# Altium project pca20053.PrjPCB (part 1 of 4)
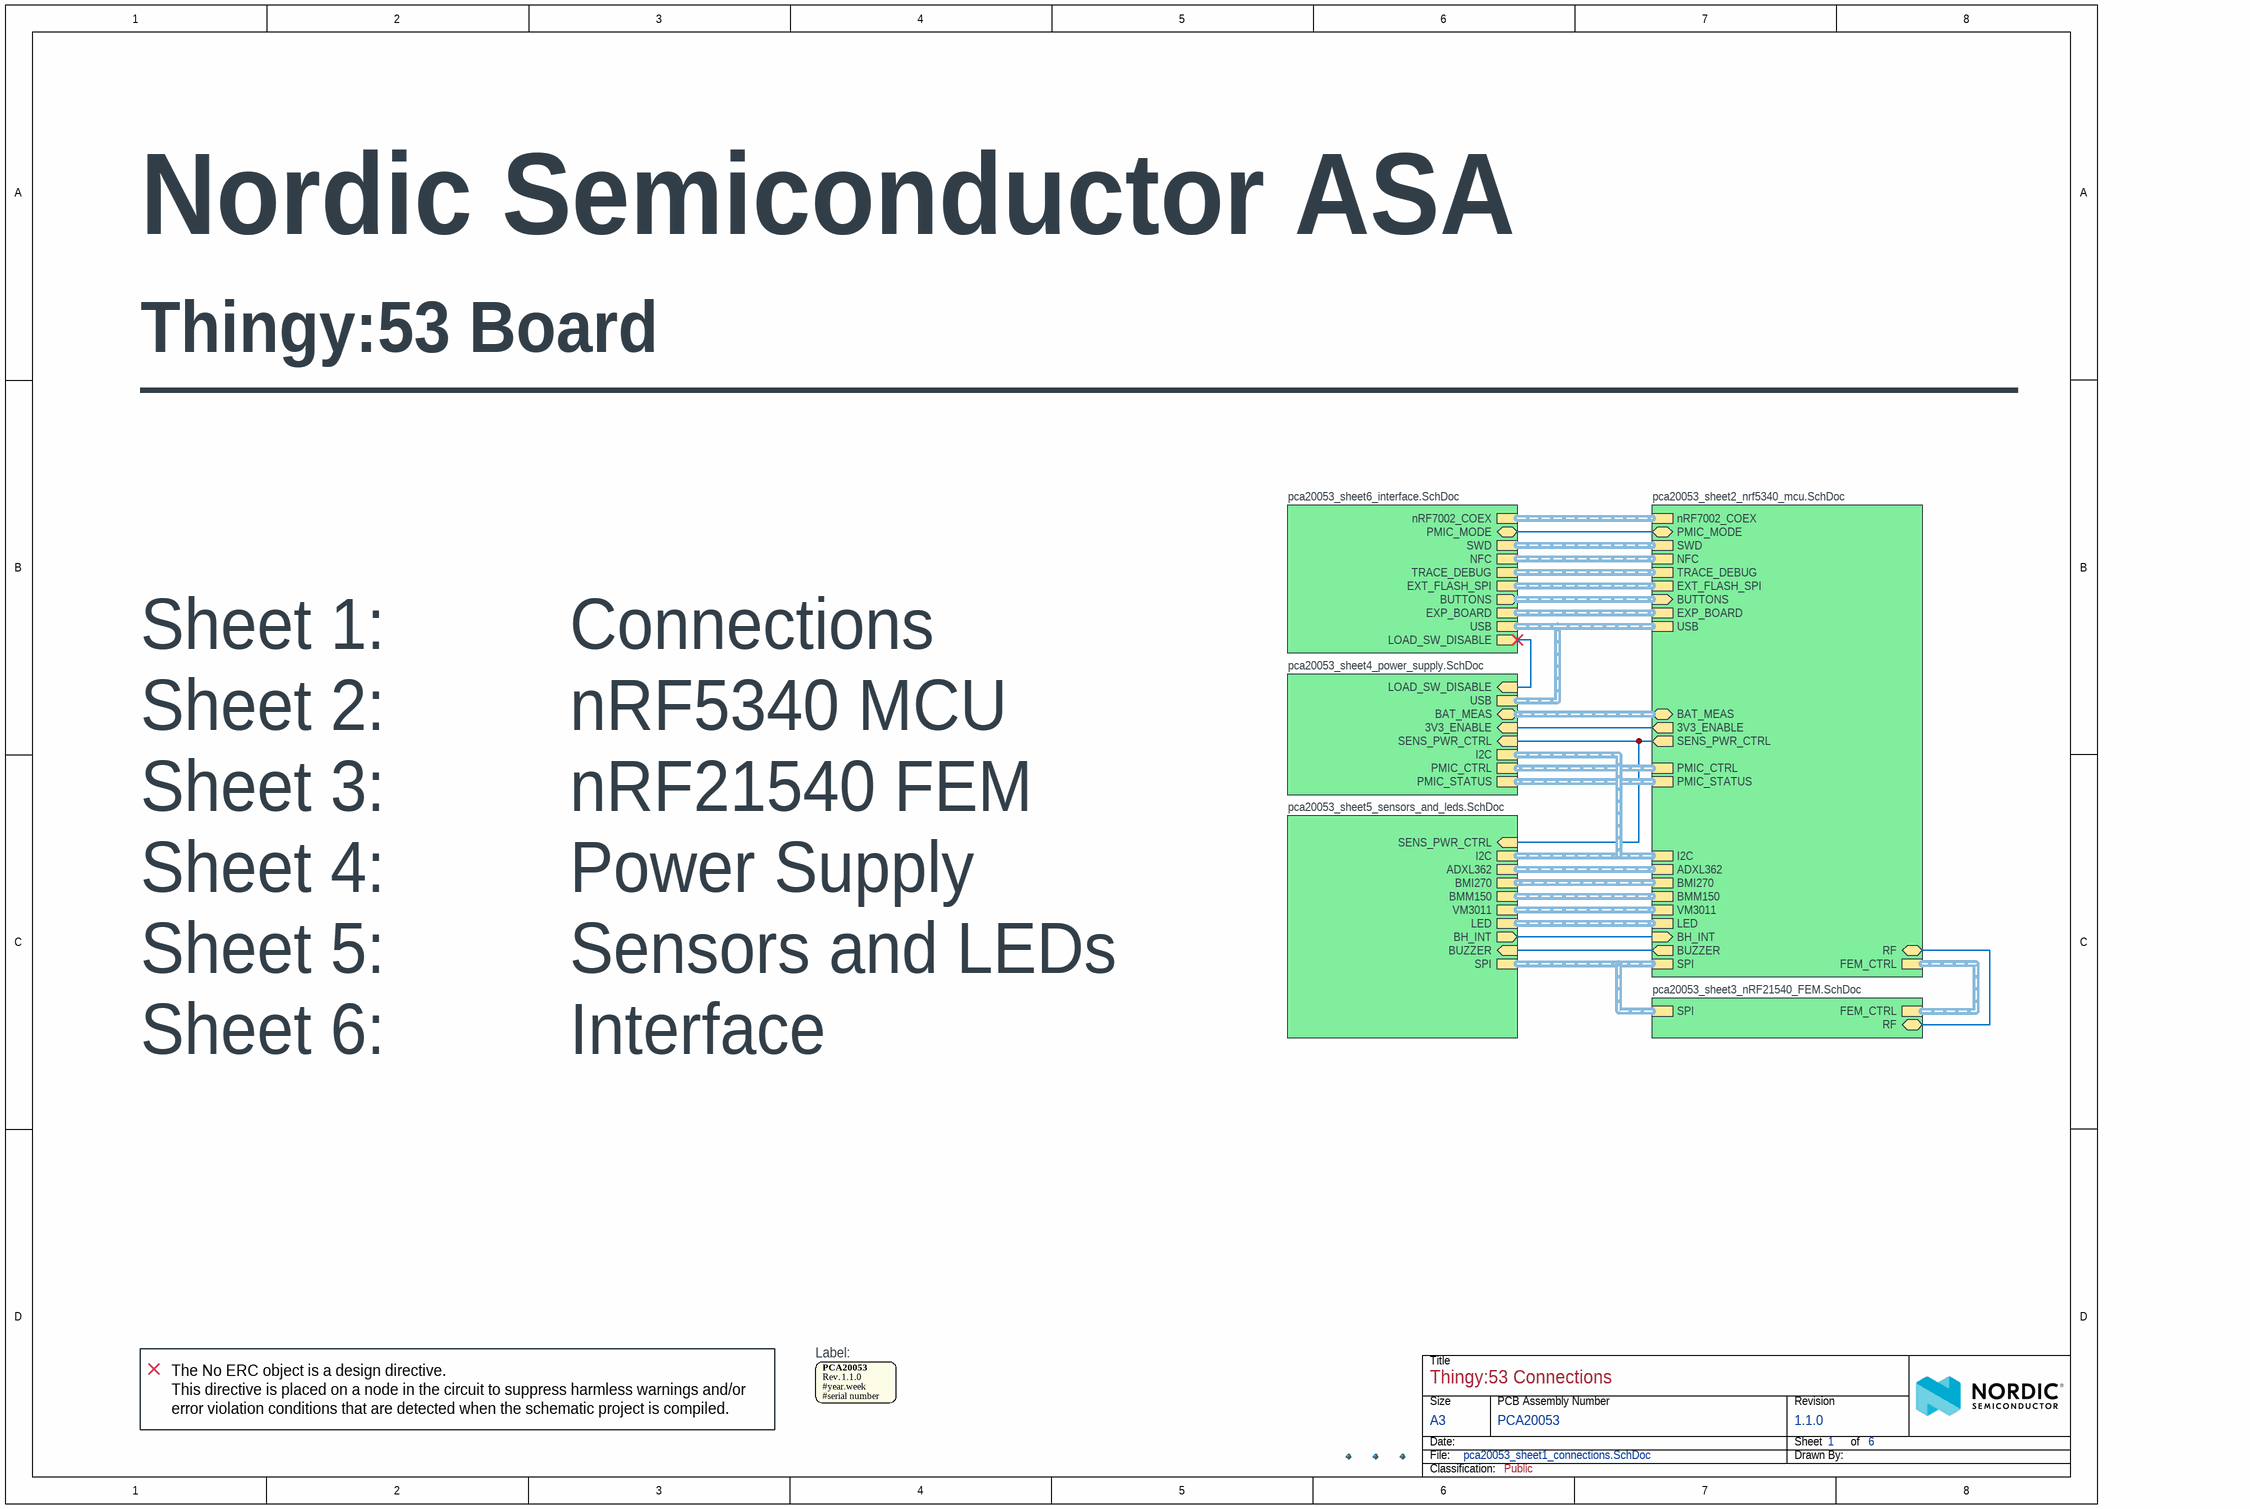
[diagram p0: pca20053_sheet1_connections.SchDoc]
Author: MASI; BoardThickness: 1.6mm; BoardTitle: Thingy:53 Board; Classification: Public; Designer: MASI; LaminateMaterial: FR4, Halogen-Free; NrOfLayers: 4; Organization: Nordic Semiconductor; PCAName: PCA20053; PCARevision: 1.1.0; PCBNumber: 400501; PCBRevision: 0059MASI; PCBStackup: 4001; ProjectName: Thingy:53; ProjectNumber: 4471; Revision: 1.1.0; SilkscreenColor: White, Halogen-Free; SoldermaskColor: Blue, Halogen-Free; SurfaceFinish: ENIG Gold
6 sheets, 236 parts. Net scope: hierarchical (ports join the sheet entries above them; power ports are global).
Board file: 400501.PcbDoc
Sheets:
  pca20053_sheet1_connections.SchDoc
     = pca20053_sheet2_nrf5340_mcu.SchDoc
     = pca20053_sheet5_sensors_and_leds.SchDoc
     = pca20053_sheet3_nRF21540_FEM.SchDoc
     = pca20053_sheet6_interface.SchDoc
     = pca20053_sheet4_power_supply.SchDoc

## Sheet pca20053_sheet1_connections.SchDoc: Thingy:53 Connections
size A3; Organization: Nordic Semiconductor; DocumentNumber: 1; Revision: 1.1.0; SheetNumber: 1; SheetTotal: 6; Author: MASI; CompanyName: Nordic Semiconductor; DrawnBy: MASI; DocumentSize: A3; ProjectName: Thingy:53

### Parts
Fid1  Fiducial mark  [Fiducial_Round-Square]  (value not drawn)
Fid2  Fiducial mark  [Fiducial_Round-Square]  (value not drawn)
Fid3  Fiducial mark  [Fiducial_Round-Square]  (value not drawn)
LABEL  8x32mm  [LabelSilk_8x32]  (value not drawn)

### Sub-sheets
? = pca20053_sheet2_nrf5340_mcu.SchDoc: USB (harness USB), SWD (harness SWD), FEM_CTRL (harness FEM_CTRL), BUZZER (out), BH_INT (in), LED (harness LED), I2C (harness I2C), BUTTONS (in, harness BUTTONS), SPI (harness SPI), BMI270 (harness BMI270), ADXL362 (harness ADXL), RF (bidir), PMIC_STATUS (harness PMIC_STATUS), NFC (harness NFC), VM3011 (harness VM3011), BMM150 (harness BMM150), TRACE_DEBUG (harness TRACE), EXT_FLASH_SPI (harness QSPI), EXP_BOARD (harness EXP_BOARD), PMIC_CTRL (harness PMIC_CTRL), BAT_MEAS (bidir, harness BAT_MEAS), 3V3_ENABLE (out), SENS_PWR_CTRL (out), PMIC_MODE (bidir), nRF7002_COEX (harness PMIC_STATUS)
? = pca20053_sheet5_sensors_and_leds.SchDoc: BUZZER (in), I2C (harness I2C), BH_INT (out), LED (harness LED), SPI (harness SPI), ADXL362 (harness ADXL), BMI270 (harness BMI270), VM3011 (harness VM3011), BMM150 (harness BMM150), SENS_PWR_CTRL (in)
? = pca20053_sheet3_nRF21540_FEM.SchDoc: FEM_CTRL (harness FEM_CTRL), RF (bidir), SPI (harness SPI)
? = pca20053_sheet6_interface.SchDoc: USB (harness USB), SWD (harness SWD), BUTTONS (out, harness BUTTONS), LOAD_SW_DISABLE (out), NFC (harness NFC), TRACE_DEBUG (harness TRACE), EXT_FLASH_SPI (harness QSPI), EXP_BOARD (harness EXP_BOARD), PMIC_MODE (bidir), nRF7002_COEX (harness PMIC_STATUS)
? = pca20053_sheet4_power_supply.SchDoc: USB (harness USB), PMIC_STATUS (harness PMIC_STATUS), LOAD_SW_DISABLE (in), PMIC_CTRL (harness PMIC_CTRL), BAT_MEAS (bidir, harness BAT_MEAS), 3V3_ENABLE (in), SENS_PWR_CTRL (in), I2C (harness I2C)

### Nets
EN: sheet /LOAD_SW_DISABLE, sheet /LOAD_SW_DISABLE
P0.15/QSPI2: sheet /3V3_ENABLE, sheet /3V3_ENABLE
P0.31: sheet /SENS_PWR_CTRL, sheet /SENS_PWR_CTRL, sheet /SENS_PWR_CTRL
P1.05: sheet /BH_INT, sheet /BH_INT
P1.15: sheet /BUZZER, sheet /BUZZER
RF: sheet /RF, sheet /RF
NetSB7_1: sheet /PMIC_MODE, sheet /PMIC_MODE

### Notes on the sheet
- Nordic Semiconductor ASA
- ___________________________________________
- Sheet 1:          Connections
- Sheet 2:          nRF5340 MCU
- Sheet 3:          nRF21540 FEM
- Sheet 4:          Power Supply
- Sheet 5:          Sensors and LEDs
- Sheet 6:          Interface
- (near LABEL) Label:
- (near LABEL) The No ERC object is a design directive.
  This directive is placed on a node in the circuit to suppress harmless warnings and/or error violation conditions that are detected when the schematic project is compiled.
- Title
- Size
- Date:
- File:
- A3
- PCB Assembly Number
- Sheet         of
- Drawn By:
- Revision
- Classification:
- (in symbol Label_8x32) Rev.; #year.week; #serial number

### Library data of the parts
Fid1-Fid3 = Fid-Mark-Round-Square: Manufacturer: N.A.; Part number NEMS: 100500075; Value: N.A.; Pad Count: 1; Component Status: Active; System: Connector; Part Number: Fid-Mark-Round-Square; Manufacturer Part Number: N.A.; LatestRevisionDate: 2017-01-30; Published: 2009-12-12; Note: N.A.; Artikkelnr Noca: N.A.; Footprint Doc: Fiducial; Part number IPS: N.A.; ComponentLink1URL: N.A.; ComponentLink1Description: Datasheet; ComponentLink2URL: N.A.; ComponentLink2Description: Supplier link; HelpURL: N.A.; Supplier 1: N.A.; Supplier Part Number 1: N.A.; Supplier 2: N.A.; Supplier Part Number 2: N.A.; Component Class: Connectors; PartId: 100500075; Author: rsk; Part number Norautron: N.A.
LABEL = Label_8x32: PCA version label, stick-on, 8x32mm; Manufacturer: Ellco Etikett; Manufacturer Part Number: 57382; Part number NEMS: 101200026; Component Status: Active; Pad Count: 0; Note: N.A.; Part Number: Label_8x32; PartId: 101200026; Component Class: Mechanicals; Author: hany; ComponentLink1URL: N.A.; ComponentLink1Description: Datasheet; ComponentLink2URL: N.A.; ComponentLink2Description: Supplier link; HelpURL: N.A.; LatestRevisionDate: 2023-01-05; Published: 2023-01-05; Footprint Doc: Label; Value: 8x32mm; Supplier 1: N.A.; Supplier Part Number 1: N.A.; Supplier 2: N.A.; Supplier Part Number 2: N.A.; Artikkelnr Noca: N.A.; Part number IPS: N.A.; Part number Norautron: N.A.

## Sheet pca20053_sheet2_nrf5340_mcu.SchDoc: Thingy:53 nRF5340 MCU
size A3; Organization: Nordic Semiconductor; DocumentNumber: 2; Revision: 1.1.0; SheetNumber: 2; SheetTotal: 6; Author: MASI; CompanyName: Nordic Semiconductor; DrawnBy: MASI; DocumentSize: A3; ProjectName: Thingy:53
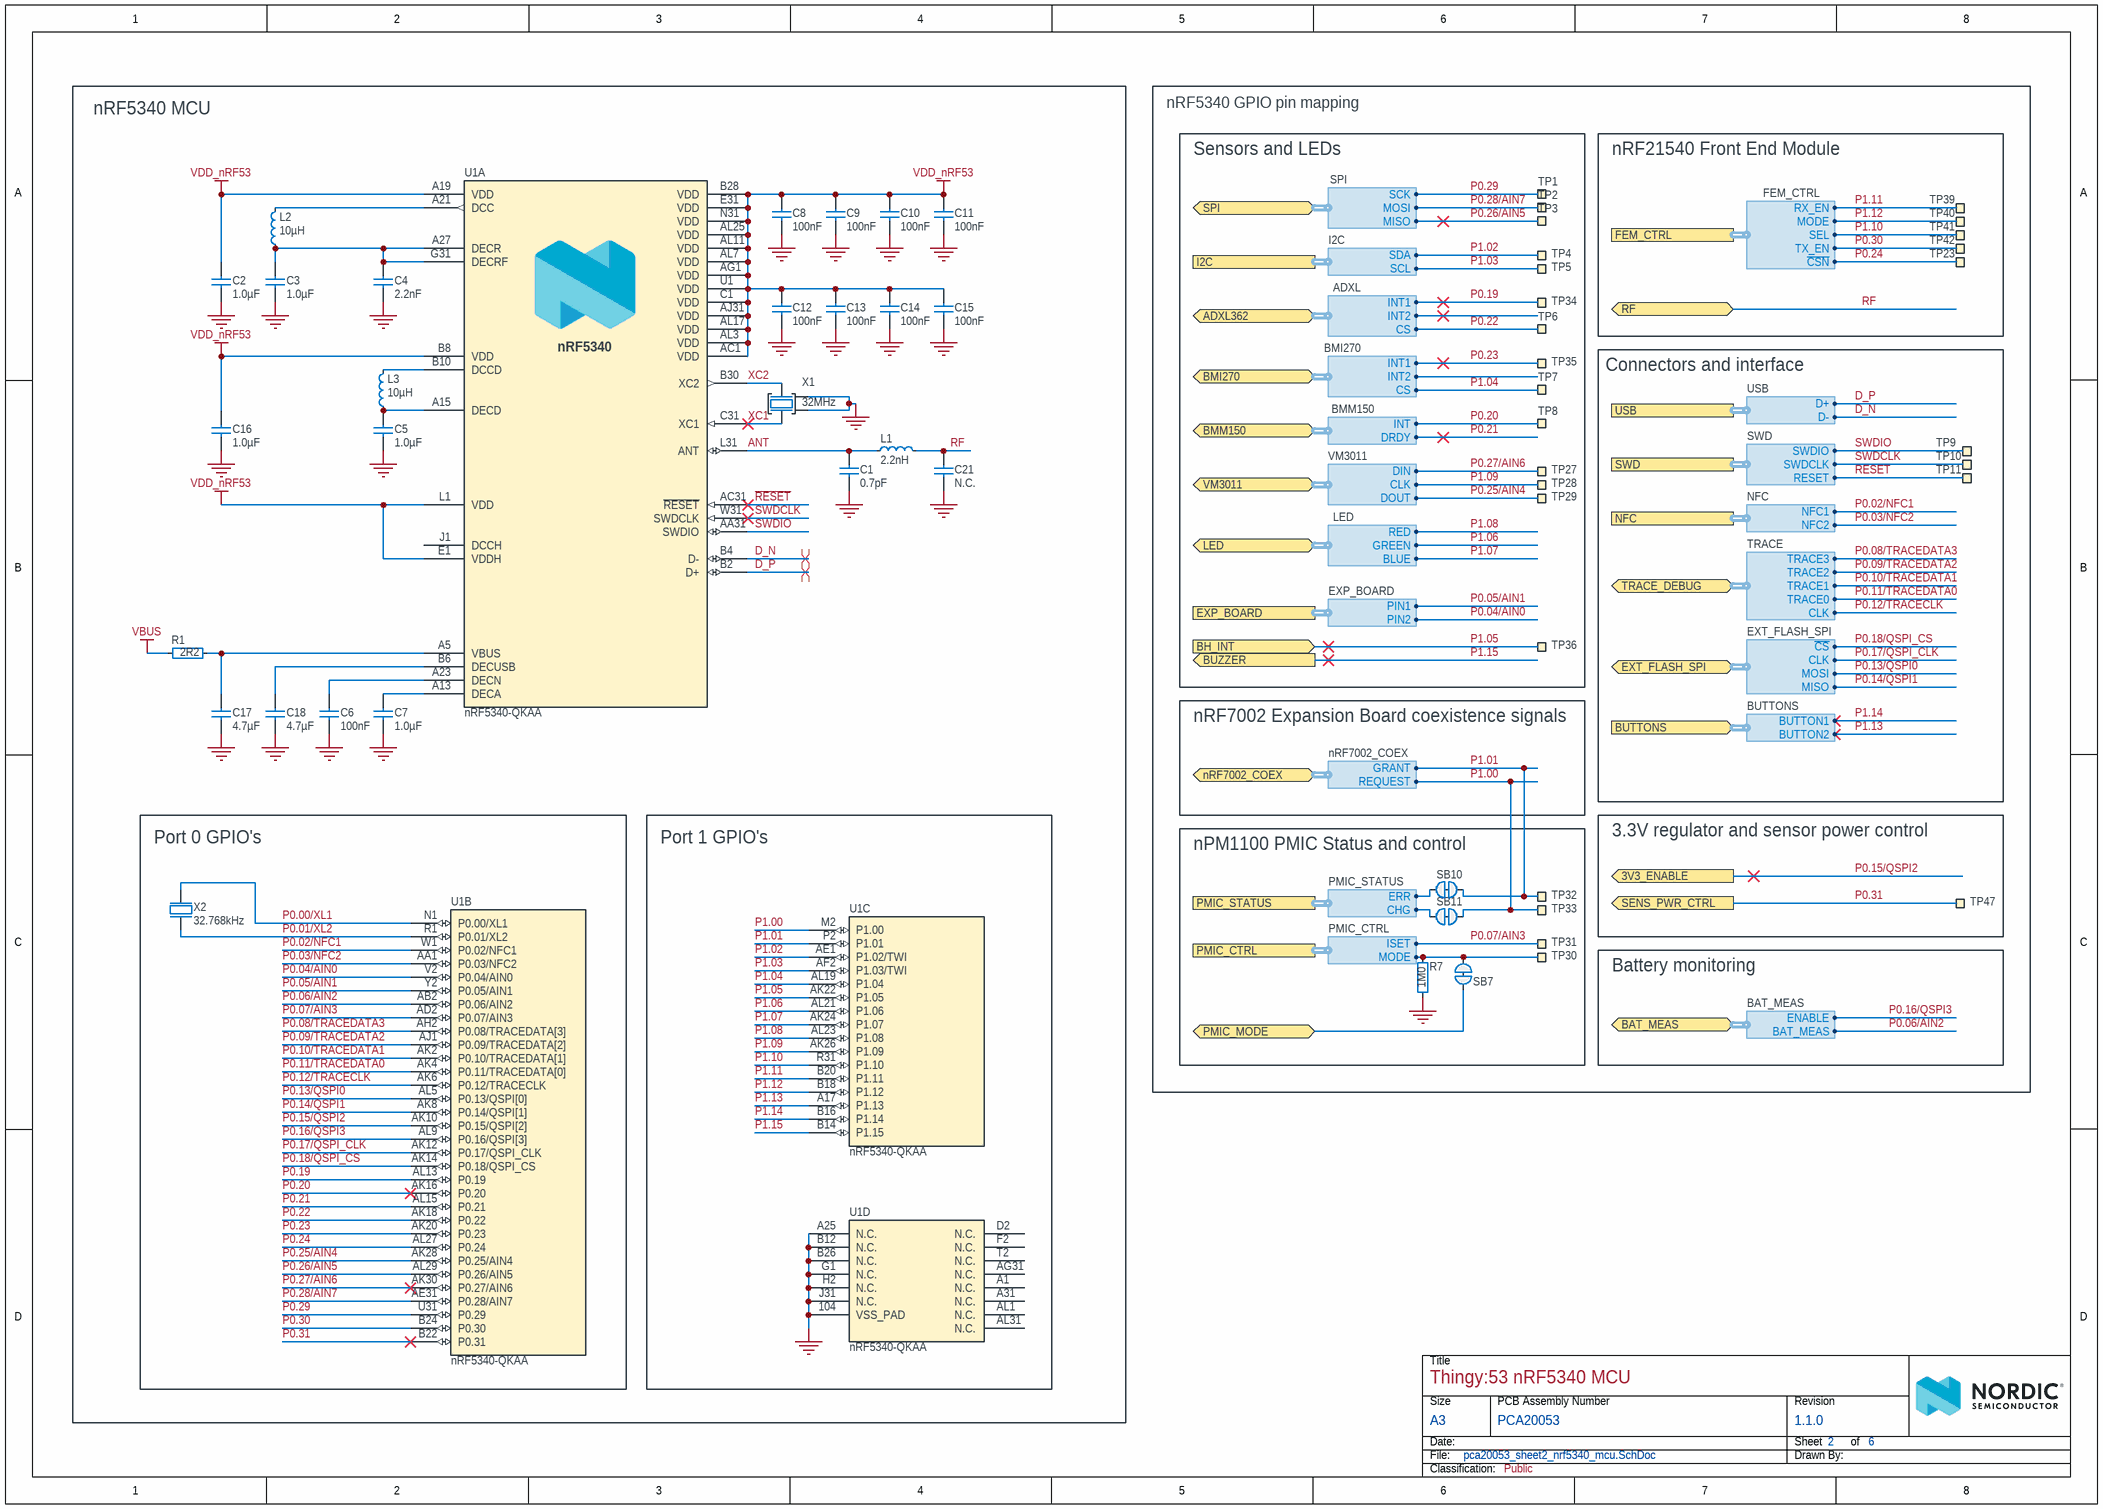
[diagram p1: pca20053_sheet2_nrf5340_mcu.SchDoc]

### Parts
C1  0.7pF  [CAPC0603X03L_C]
C2  1.0µF  [CAPC1005X04L]
C3  1.0µF  [CAPC1005X04L]
C4  2.2nF  [CAPC0603X03L_C]
C5  1.0µF  [CAPC1005X04L]
C6  100nF  [CAPC0603X03L_C]
C7  1.0µF  [CAPC1005X04L]
C8  100nF  [CAPC0603X03L_C]
C9  100nF  [CAPC0603X03L_C]
C10  100nF  [CAPC0603X03L_C]
C11  100nF  [CAPC0603X03L_C]
C12  100nF  [CAPC0603X03L_C]
C13  100nF  [CAPC0603X03L_C]
C14  100nF  [CAPC0603X03L_C]
C15  100nF  [CAPC0603X03L_C]
C16  1.0µF  [CAPC1005X04L]
C17  4.7µF  [CAPC1608X06L]
C18  4.7µF  [CAPC1608X06L]
C21  N.C.  [CAPC0603X03L_C_NC]
L1  2.2nH  [INDC0603X03L_C]
L2  10µH  [INDC1608X06L]
L3  10µH  [INDC1608X06L]
R1  2R2  [RESC0603X03L_C]
R7  1M0  [RESC0603X03L_C]
SB7  Solderbridge  [Solderbridge_Shorted]  (value not drawn)  (net tie, no BOM)
SB10  Solderbridge  [Solderbridge_Shorted]  (value not drawn)  (net tie, no BOM)
SB11  Solderbridge  [Solderbridge_Shorted]  (value not drawn)  (net tie, no BOM)
TP1  Ø1.5mm,SMD  [TP_SMD_D1.5mm]  (value not drawn)  (no BOM)
TP2  Ø1.5mm,SMD  [TP_SMD_D1.5mm]  (value not drawn)  (no BOM)
TP3  Ø1.5mm,SMD  [TP_SMD_D1.5mm]  (value not drawn)  (no BOM)
TP4  Ø1.5mm,SMD  [TP_SMD_D1.5mm]  (value not drawn)  (no BOM)
TP5  Ø1.5mm,SMD  [TP_SMD_D1.5mm]  (value not drawn)  (no BOM)
TP6  Ø1.0mm,SMD  [TP_SMD_D1.0mm]  (value not drawn)  (no BOM)
TP7  Ø1.0mm,SMD  [TP_SMD_D1.0mm]  (value not drawn)  (no BOM)
TP8  Ø1.0mm,SMD  [TP_SMD_D1.0mm]  (value not drawn)  (no BOM)
TP9  Ø1.5mm,SMD  [TP_SMD_D1.5mm]  (value not drawn)  (no BOM)
TP10  Ø1.5mm,SMD  [TP_SMD_D1.5mm]  (value not drawn)  (no BOM)
TP11  Ø1.5mm,SMD  [TP_SMD_D1.5mm]  (value not drawn)  (no BOM)
TP23  Ø1.5mm,SMD  [TP_SMD_D1.5mm]  (value not drawn)  (no BOM)
TP27  Ø0.7mm,SMD  [TP_SMD_D0.7mm]  (value not drawn)  (no BOM)
TP28  Ø0.7mm,SMD  [TP_SMD_D0.7mm]  (value not drawn)  (no BOM)
TP29  Ø0.7mm,SMD  [TP_SMD_D0.7mm]  (value not drawn)  (no BOM)
TP30  Ø0.7mm,SMD  [TP_SMD_D0.7mm]  (value not drawn)  (no BOM)
TP31  Ø0.7mm,SMD  [TP_SMD_D0.7mm]  (value not drawn)  (no BOM)
TP32  Ø1.5mm,SMD  [TP_SMD_D1.5mm]  (value not drawn)  (no BOM)
TP33  Ø1.5mm,SMD  [TP_SMD_D1.5mm]  (value not drawn)  (no BOM)
TP34  Ø0.7mm,SMD  [TP_SMD_D0.7mm]  (value not drawn)  (no BOM)
TP35  Ø0.7mm,SMD  [TP_SMD_D0.7mm]  (value not drawn)  (no BOM)
TP36  Ø0.7mm,SMD  [TP_SMD_D0.7mm]  (value not drawn)  (no BOM)
TP39  Ø1.5mm,SMD  [TP_SMD_D1.5mm]  (value not drawn)  (no BOM)
TP40  Ø1.5mm,SMD  [TP_SMD_D1.5mm]  (value not drawn)  (no BOM)
TP41  Ø1.5mm,SMD  [TP_SMD_D1.5mm]  (value not drawn)  (no BOM)
TP42  Ø1.5mm,SMD  [TP_SMD_D1.5mm]  (value not drawn)  (no BOM)
TP47  Ø0.7mm,SMD  [TP_SMD_D0.7mm]  (value not drawn)  (no BOM)
U1  nRF5340-QKAA  [AQFN40P700X700X85_HS-99N]  (parts A,B,C,D of 4)
X1  32MHz  [BT-XTAL_2016]
X2  32.768kHz  [XTAL_2012]

### Blocks framed on the sheet
nRF5340 MCU: C1-C18 C21 L1-L3 R1 U1 X1
Sensors and LEDs: TP1-TP8 TP27-TP29 TP34-TP36
nRF21540 Front End Module: TP23 TP39-TP42
Connectors and interface: TP9-TP11
Port 0 GPIO's: U1 X2
Port 1 GPIO's: U1
3.3V regulator and sensor power control: TP47
nPM1100 PMIC Status and control: R7 SB7 SB10 SB11 TP30-TP33

### Ports
3V3_ENABLE (out), ADXL362 (bidir, harness ADXL), BAT_MEAS (bidir, harness BAT_MEAS), BH_INT (in), BMI270 (bidir, harness BMI270), BMM150 (bidir, harness BMM150), BUTTONS (in, harness BUTTONS), BUZZER (out), EXP_BOARD (harness EXP_BOARD), EXT_FLASH_SPI (bidir, harness EXT_FLASH_SPI), FEM_CTRL (harness FEM_CTRL), I2C (harness I2C), LED (bidir, harness LED), NFC (harness NFC), nRF7002_COEX (bidir, harness nRF7002_COEX), PMIC_CTRL (harness PMIC_CTRL), PMIC_MODE (bidir), PMIC_STATUS (harness PMIC_STATUS), RF (bidir), SENS_PWR_CTRL (out), SPI (bidir, harness SPI), SWD (harness SWD), TRACE_DEBUG (bidir, harness TRACE), USB (harness USB), VM3011 (bidir, harness VM3011)

### Harnesses
VM3011: DIN, CLK, DOUT
LED: BLUE, GREEN, RED
SPI: MISO, MOSI, SCK
BMI270: INT2, INT1, CS
ADXL: CS, INT2, INT1
SWD: SWDIO, SWDCLK, RESET
USB: D+, D-
NFC: NFC2, NFC1
I2C: SCL, SDA
FEM_CTRL: MODE, RX_EN, SEL, TX_EN, ~{CSN}
TRACE: TRACE3, TRACE2, TRACE1, TRACE0, CLK
BMM150: DRDY, INT
EXT_FLASH_SPI: ~{CS}, CLK, MOSI, MISO
EXP_BOARD: PIN1, PIN2
PMIC_CTRL: ISET, MODE
PMIC_STATUS: ERR, CHG
BAT_MEAS: BAT_MEAS, ENABLE
BUTTONS: BUTTON1, BUTTON2
nRF7002_COEX: REQUEST, GRANT

### Nets
GND: C1.1 C2.2 C3.1 C4.2 C5.1 C6.2 C7.1 C8.2 C9.2 C10.2 C11.2 C12.2 C13.2 C14.2 C15.2 C16.1 C17.2 C18.2 C21.1 R7.1 U1.104(VSS_PAD) U1.A25(N.C.) U1.B12(N.C.) U1.B26(N.C.) U1.G1(N.C.) U1.H2(N.C.) U1.J31(N.C.) X1.2(GND) X1.4(GND)
VBUS: R1.1
VDD_nRF53: C2.1 C8.1 C9.1 C10.1 C11.1 C12.1 C13.1 C14.1 C15.1 C16.2 U1.A19(VDD) U1.AC1(VDD) U1.AG1(VDD) U1.AJ31(VDD) U1.AL3(VDD) U1.AL7(VDD) U1.AL11(VDD) U1.AL17(VDD) U1.AL25(VDD) U1.B8(VDD) U1.B28(VDD) U1.C1(VDD) U1.E1(VDDH) U1.E31(VDD) U1.L1(VDD) U1.N31(VDD) U1.U1(VDD)
ANT: C1.2 L1.2 U1.L31(ANT)
CHG: SB11.2 ; port PMIC_STATUS.CHG
D_N: U1.B4(D-) ; port USB.D-
D_P: U1.B2(D+) ; port USB.D+
ERR: SB10.2 ; port PMIC_STATUS.ERR
MODE: R7.2 SB7.2 TP30.1 ; port PMIC_CTRL.MODE
P0.00/XL1: U1.N1(P0.00/XL1) X2.1(inp)
P0.01/XL2: U1.R1(P0.01/XL2) X2.2(out)
P0.02/NFC1: U1.W1(P0.02/NFC1) ; port NFC.NFC1
P0.03/NFC2: U1.AA1(P0.03/NFC2) ; port NFC.NFC2
P0.04/AIN0: U1.V2(P0.04/AIN0) ; port EXP_BOARD.PIN2  [project net EXP_BOARD_PIN2]
P0.05/AIN1: U1.Y2(P0.05/AIN1) ; port EXP_BOARD.PIN1  [project net EXP_BOARD_PIN1]
P0.06/AIN2: U1.AB2(P0.06/AIN2) ; port BAT_MEAS.BAT_MEAS
P0.07/AIN3: TP31.1 U1.AD2(P0.07/AIN3) ; port PMIC_CTRL.ISET  [project net ISET]
P0.08/TRACEDATA3: U1.AH2(P0.08/TRACEDATA[3]) ; port TRACE_DEBUG.TRACE3
P0.09/TRACEDATA2: U1.AJ1(P0.09/TRACEDATA[2]) ; port TRACE_DEBUG.TRACE2
P0.10/TRACEDATA1: U1.AK2(P0.10/TRACEDATA[1]) ; port TRACE_DEBUG.TRACE1
P0.11/TRACEDATA0: U1.AK4(P0.11/TRACEDATA[0]) ; port TRACE_DEBUG.TRACE0
P0.12/TRACECLK: U1.AK6(P0.12/TRACECLK) ; port TRACE_DEBUG.CLK
P0.13/QSPI0: U1.AL5(P0.13/QSPI[0]) ; port EXT_FLASH_SPI.MOSI
P0.14/QSPI1: U1.AK8(P0.14/QSPI[1]) ; port EXT_FLASH_SPI.MISO
P0.15/QSPI2: U1.AK10(P0.15/QSPI[2]) ; port 3V3_ENABLE
P0.16/QSPI3: U1.AL9(P0.16/QSPI[3]) ; port BAT_MEAS.ENABLE
P0.17/QSPI_CLK: U1.AK12(P0.17/QSPI_CLK) ; port EXT_FLASH_SPI.CLK
P0.18/QSPI_CS: U1.AK14(P0.18/QSPI_CS) ; port EXT_FLASH_SPI.~{CS}
P0.19: TP34.1 U1.AL13(P0.19) ; port ADXL362.INT1
P0.20: TP8.1 U1.AK16(P0.20) ; port BMM150.INT
P0.21: U1.AL15(P0.21) ; port BMM150.DRDY
P0.22: TP6.1 U1.AK18(P0.22) ; port ADXL362.CS
P0.23: TP35.1 U1.AK20(P0.23) ; port BMI270.INT1
P0.24: TP23.1 U1.AL27(P0.24) ; port FEM_CTRL.~{CSN}
P0.25/AIN4: TP29.1 U1.AK28(P0.25/AIN4) ; port VM3011.DOUT
P0.26/AIN5: TP3.1 U1.AL29(P0.26/AIN5) ; port SPI.MISO  [project net MISO]
P0.27/AIN6: TP27.1 U1.AK30(P0.27/AIN6) ; port VM3011.DIN
P0.28/AIN7: TP2.1 U1.AE31(P0.28/AIN7) ; port SPI.MOSI  [project net MOSI]
P0.29: TP1.1 U1.U31(P0.29) ; port SPI.SCK
P0.30: TP42.1 U1.B24(P0.30) ; port FEM_CTRL.TX_EN
P0.31: TP47.1 U1.B22(P0.31) ; port SENS_PWR_CTRL
P1.00: SB11.1 TP33.1 U1.M2(P1.00) ; port nRF7002_COEX.REQUEST
P1.01: SB10.1 TP32.1 U1.P2(P1.01) ; port nRF7002_COEX.GRANT
P1.02: TP4.1 U1.AE1(P1.02/TWI) ; port I2C.SDA
P1.03: TP5.1 U1.AF2(P1.03/TWI) ; port I2C.SCL
P1.04: TP7.1 U1.AL19(P1.04) ; port BMI270.CS
P1.05: TP36.1 U1.AK22(P1.05) ; port BH_INT
P1.06: U1.AL21(P1.06) ; port LED.GREEN
P1.07: U1.AK24(P1.07) ; port LED.BLUE
P1.08: U1.AL23(P1.08) ; port LED.RED
P1.09: TP28.1 U1.AK26(P1.09) ; port VM3011.CLK
P1.10: TP41.1 U1.R31(P1.10) ; port FEM_CTRL.SEL
P1.11: TP39.1 U1.B20(P1.11) ; port FEM_CTRL.RX_EN
P1.12: TP40.1 U1.B18(P1.12) ; port FEM_CTRL.MODE
P1.13: U1.A17(P1.13) ; port BUTTONS.BUTTON2
P1.14: U1.B16(P1.14) ; port BUTTONS.BUTTON1
P1.15: U1.B14(P1.15) ; port BUZZER
~{RESET}: TP11.1 U1.AC31(~{RESET}) ; port SWD.RESET
RF: C21.2 L1.1 ; port RF
SWDCLK: TP10.1 U1.W31(SWDCLK) ; port SWD.SWDCLK
SWDIO: TP9.1 U1.AA31(SWDIO) ; port SWD.SWDIO
XC1: U1.C31(XC1) X1.1(IN)
XC2: U1.B30(XC2) X1.3(OUT)
NetC3_2: C3.2 C4.1 L2.1 U1.A27(DECR) U1.G31(DECRF)
NetC5_2: C5.2 L3.1 U1.A15(DECD)
NetC6_1: C6.1 U1.A23(DECN)
NetC7_2: C7.2 U1.A13(DECA)
NetC17_1: C17.1 R1.2 U1.A5(VBUS)
NetC18_1: C18.1 U1.B6(DECUSB)
NetL2_2: L2.2 U1.A21(DCC)
NetL3_2: L3.2 U1.B10(DCCD)
NetSB7_1: SB7.1 ; port PMIC_MODE

Not connected (* = marked no-connect by the designer): U1 A1(N.C.) A31(N.C.) AG31(N.C.) AL1(N.C.) AL31(N.C.) D2(N.C.) F2(N.C.) J1(DCCH) T2(N.C.)

### Layout directives
differential pair: D_N, D_P

### Notes on the sheet
- nRF5340 GPIO pin mapping
- nRF7002 Expansion Board coexistence signals
- Battery monitoring
- Title
- Size
- Date:
- File:
- A3
- PCB Assembly Number
- Sheet         of
- Drawn By:
- Revision
- Classification:
- (in symbol nRF5340-QKAAD0, part A) nRF5340

### Library data of the parts
C1 = C0201-0.7p-50V-C0G-GJM0335C1HR70WB01: Capacitor, Ceramic, C0G, ±0.05pF, 50V; Manufacturer: Murata; Manufacturer Part Number: GJM0335C1HR70WB01D; Part number NEMS: 100200011; Artikkelnr Noca: N.A.; Pad Count: 2; Component Status: Active; Part Number: C0201-0.7p-50V-C0G-GJM0335C1HR70WB01; LatestRevisionDate: 2023-03-27; Published: 2014-11-13; Value: 0.7pF; Footprint Doc: 0201; Component Class: Capacitors; ComponentLink1Description: Datasheet; ComponentLink1URL: https://search.murata.co.jp/Ceramy/image/img/A01X/G101/ENG/GJM0335C1HR70WB01-01.pdf; ComponentLink2Description: Supplier link; ComponentLink2URL: https://www.murata.com/en-global/products/productdetail?partno=GJM0335C1HR70WB01%23; HelpURL: N.A.; Note: 50V; PartId: 100200011; Part number IPS: N.A.; Supplier 1: Digi-Key; Supplier 2: Mouser; Supplier Part Number 1: 490-17145-1-ND; Supplier Part Number 2: 81-GJM0335C1HR70WB1D; Author: rsk; Part number Norautron: N.A.
C2 C3 C5 C7 C16 = C0402-1µ0-25V-X5R: Capacitor, Ceramic, X5R, ±10%, 25V; Manufacturer: Murata; Manufacturer Part Number: GRM155R61E105KA12D; Part number NEMS: 100200453; Artikkelnr Noca: N.A.; Pad Count: 2; Component Status: Active; Part Number: C0402-1µ0-25V-X5R; LatestRevisionDate: 2020-12-16; Published: 2020-12-16; Value: 1.0µF; Footprint Doc: 0402; Component Class: Capacitors; ComponentLink1Description: Datasheet; ComponentLink1URL: https://search.murata.co.jp/Ceramy/image/img/A01X/G101/ENG/GRM155R61E105KA12-01.pdf; ComponentLink2Description: Supplier link; ComponentLink2URL: https://www.murata.com/en-global/products/productdetail?partno=GRM155R61E105KA12%23; HelpURL: N.A.; Note: 25V; PartId: 100200453; Part number IPS: N.A.; Supplier 1: Digi-Key; Supplier 2: Mouser; Supplier Part Number 1: 490-10017-1-ND; Supplier Part Number 2: 81-GRM155R61E105KA2D; Author: rsk; Part number Norautron: N.A.
C4 = C0201-2n2-10V-X5R: Capacitor, Ceramic, X5R, ±10%, 10V; Manufacturer: Murata; Manufacturer Part Number: GRM033R61A222KA01D; Part number NEMS: 100200455; Artikkelnr Noca: N.A.; Pad Count: 2; Component Status: Active; Part Number: C0201-2n2-10V-X5R; LatestRevisionDate: 2020-12-16; Published: 2020-12-16; Value: 2.2nF; Footprint Doc: 0201; ComponentLink1URL: https://search.murata.co.jp/Ceramy/image/img/A01X/G101/ENG/GRM033R61A222KA01-01.pdf; ComponentLink1Description: Datasheet; ComponentLink2URL: https://www.murata.com/en-global/products/productdetail?partno=GRM033R61A222KA01%23; ComponentLink2Description: Supplier link; HelpURL: N.A.; Note: 10V; Supplier 1: Digi-Key; Supplier Part Number 1: 490-3162-1-ND; Supplier 2: Mouser; Supplier Part Number 2: 81-GRM033R61A222KA1D; Part number IPS: N.A.; Component Class: Capacitors; PartId: 100200455; Author: rsk; Part number Norautron: N.A.
C6 C8-C15 = C0201-100n-6.3V-X5R: Capacitor, Ceramic, X5R, ±10%, 6.3V; Manufacturer: Murata; Manufacturer Part Number: GRM033R60J104KE19D; Part number NEMS: 100200451; Artikkelnr Noca: N.A.; Pad Count: 2; Component Status: Active; Part Number: C0201-100n-6.3V-X5R; LatestRevisionDate: 2020-12-15; Published: 2020-12-15; Value: 100nF; Footprint Doc: 0201; Component Class: Capacitors; ComponentLink1Description: Datasheet; ComponentLink1URL: https://search.murata.co.jp/Ceramy/image/img/A01X/G101/ENG/GRM033R60J104KE19-01.pdf; ComponentLink2Description: Supplier link; ComponentLink2URL: https://www.murata.com/en-eu/products/productdetail?partno=GRM033R60J104KE19%23; HelpURL: N.A.; Note: 6.3V; PartId: 100200451; Part number IPS: N.A.; Supplier 1: Digi-Key; Supplier 2: N.A.; Supplier Part Number 1: 490-3167-1-ND; Supplier Part Number 2: N.A.; Author: rsk; Part number Norautron: N.A.
C17 C18 = C0603-4µ7-25V-X5R: Capacitor, X5R, ±10%, 25V; Manufacturer: Murata; Manufacturer Part Number: GRM188R61E475KE11D; Part number NEMS: 100200352; Artikkelnr Noca: N.A.; Pad Count: 2; Component Status: Active; Part Number: C0603-4µ7-25V-X5R; LatestRevisionDate: 2019-06-11; Published: 2019-06-11; Value: 4.7µF; Footprint Doc: 0603; Component Class: Capacitors; ComponentLink1Description: Datasheet; ComponentLink1URL: https://www.murata.com/~/media/webrenewal/support/library/catalog/products/capacitor/mlcc/c02e.ashx?la=en-us; ComponentLink2Description: Supplier link; ComponentLink2URL: https://www.digikey.com/product-detail/en/murata-electronics-north-america/GRM188R61E475KE11D/490-7203-1-ND/3900450; HelpURL: https://www.murata.com/~/media/webrenewal/support/library/catalog/products/capacitor/mlcc/c02e.ashx?la=en-us; Note: 25V; PartId: 100200352; Part number IPS: N.A.; Supplier 1: Digi-Key; Supplier 2: N.A.; Supplier Part Number 1: 490-7203-1-ND; Supplier Part Number 2: N.A.; Author: rsk; Part number Norautron: N.A.
C21 = C0201-N.C.: Not mounted; Part number NEMS: 100200001; Assembly: Not mounted; Artikkelnr Noca: N.A.; Note: Chip Cap; Pad Count: 2; Component Status: Active; Part Number: C0201-N.C.; LatestRevisionDate: 2014-11-13; Published: 2014-11-13; Value: N.C.; Footprint Doc: 0201; Component Class: Capacitors; ComponentLink1Description: Datasheet; ComponentLink1URL: N.A.; ComponentLink2Description: Supplier link; ComponentLink2URL: N.A.; HelpURL: N.A.; Manufacturer: N.A.; Manufacturer Part Number: N.A.; PartId: 100200001; Part number IPS: N.A.; Supplier 1: N.A.; Supplier 2: N.A.; Supplier Part Number 1: N.A.; Supplier Part Number 2: N.A.; Author: rsk; Part number Norautron: N.A.
L1 = L0201-2n2-HQ-Murata: Inductor, 600mA, ±0.1ｎH, 120mOhm; Manufacturer: Murata; Manufacturer Part Number: LQP03HQ2N2B02; Part number Norautron: 26521773; Part number NEMS: 100300209; Artikkelnr Noca: N.A.; Note: -55°C ~ 125°C; Pad Count: 2; Component Status: Active; Part Number: L0201-2n2-HQ-Murata; Footprint Doc: 0201; LatestRevisionDate: 2018-10-23; Published: 2018-10-23; Value: 2.2nH; Component Class: Inductors; ComponentLink1Description: Datasheet; ComponentLink1URL: https://search.murata.co.jp/Ceramy/image/img/P02/JELF243C-0021.pdf; ComponentLink2Description: Supplier link; ComponentLink2URL: N.A.; HelpURL: https://psearch.en.murata.com/inductor/product/LQP03HQ2N2B02%23.html; PartId: 100300209; Part number IPS: N.A.; Supplier 1: Digi-Key; Supplier 2: N.A.; Supplier Part Number 1: 490-13899-1-ND; Supplier Part Number 2: N.A.; Author: rsk
L2 L3 = L0603-10µ-Murata-DN: Inductor, 100mA, ±20%, 1.05Ohm; Manufacturer: Murata; Manufacturer Part Number: LQM18DN100M70L; Part number NEMS: 100300403; Artikkelnr Noca: N.A.; Note: -55°C ~ 125°C; Pad Count: 2; Component Status: Active; Part Number: L0603-10µ-Murata-DN; LatestRevisionDate: 2021-04-27; Published: 2021-04-27; Value: 10µH; Footprint Doc: 0603; Component Class: Inductors; ComponentLink1Description: Datasheet; ComponentLink1URL: https://search.murata.co.jp/Ceramy/image/img/P02/JELF243B-0086.pdf; ComponentLink2Description: Supplier link; ComponentLink2URL: https://www.digikey.com/en/products/detail/murata-electronics/LQM18DN100M70L/12476609; HelpURL: https://www.murata.com/en-global/products/productdetail?partno=LQM18DN100M70%23; Part number IPS: N.A.; Supplier 1: Digi-Key; Supplier 2: N.A.; Supplier Part Number 1: 490-LQM18DN100M70LCT-ND; Supplier Part Number 2: N.A.; Author: rubr; Part number Norautron: N.A.; PartId: 100300403
R1 = R0201-2R2: Resistor, ±1%, 0.05W; Part number Norautron: 26470029; Part number NEMS: 100100006; Artikkelnr Noca: N.A.; Note: Chip Res 1%; Pad Count: 2; Component Status: Active; Part Number: R0201-2R2; Footprint Doc: 0201; LatestRevisionDate: 2014-11-13; Published: 2014-11-13; Value: 2R2; Component Class: Resistors; ComponentLink1Description: Datasheet; ComponentLink1URL: N.A.; ComponentLink2Description: Supplier link; ComponentLink2URL: N.A.; HelpURL: N.A.; Manufacturer: N.A.; Manufacturer Part Number: N.A.; PartId: 100100006; Part number IPS: N.A.; Supplier 1: N.A.; Supplier 2: N.A.; Supplier Part Number 1: N.A.; Supplier Part Number 2: N.A.; Author: rsk
R7 = R0201-1M0: Resistor, ±1%, 0.05W; Manufacturer: N.A.; Part number IPS: 00000001418; Part number Norautron: 26107108; Part number NEMS: 100100093; Pad Count: 2; Note: Chip Res 1%; Component Status: Active; Part Number: R0201-1M0; PartId: 100100093; Component Class: Resistors; Manufacturer Part Number: N.A.; ComponentLink1URL: N.A.; ComponentLink1Description: Datasheet; ComponentLink2URL: N.A.; ComponentLink2Description: Supplier link; HelpURL: N.A.; Footprint Doc: 0201; LatestRevisionDate: 2014-11-13; Published: 2014-11-13; Value: 1M0; Supplier 1: N.A.; Supplier Part Number 1: N.A.; Supplier 2: N.A.; Supplier Part Number 2: N.A.; Artikkelnr Noca: N.A.; Author: rsk
SB7 = Solderbridge Shorted: Shorted Solderbridge; Manufacturer: N.A.; Part number NEMS: 100500459; Pad Count: 2; Component Status: Active; System: Connector; Part Number: Solderbridge Shorted; PartId: 100500459; Component Class: Connectors; Author: rsk; Manufacturer Part Number: N.A.; ComponentLink1URL: N.A.; ComponentLink1Description: Datasheet; ComponentLink2URL: N.A.; ComponentLink2Description: Supplier link; HelpURL: N.A.; Footprint Doc: Solderbridge_Shorted; LatestRevisionDate: 2012-08-07; Published: 2012-08-07; Value: Solderbridge; Note: N.A.; Supplier 1: N.A.; Supplier Part Number 1: N.A.; Supplier 2: N.A.; Supplier Part Number 2: N.A.; Artikkelnr Noca: N.A.; Part number IPS: N.A.; Part number Norautron: N.A.
SB10 SB11 = Solderbridge Shorted: Shorted Solderbridge; Manufacturer: N.A.; Part number NEMS: 100500459; Component Status: Active; Pad Count: 2; System: Connector; Part Number: Solderbridge Shorted; PartId: 100500459; Component Class: Connectors; Author: rsk; Manufacturer Part Number: N.A.; ComponentLink1URL: N.A.; ComponentLink1Description: Datasheet; ComponentLink2URL: N.A.; ComponentLink2Description: Supplier link; HelpURL: N.A.; LatestRevisionDate: 2012-08-07; Published: 2012-08-07; Footprint Doc: Solderbridge_Shorted; Value: Solderbridge; Note: N.A.; Supplier 1: N.A.; Supplier Part Number 1: N.A.; Supplier 2: N.A.; Supplier Part Number 2: N.A.; Artikkelnr Noca: N.A.; Part number IPS: N.A.; Part number Norautron: N.A.
TP1-TP5 TP9-TP11 TP23 TP32 TP33 TP39-TP42 = TP_SMD_Ø1.5MM: 1.5mm circular SMD testpad; Manufacturer: Nordic Semiconductor; Manufacturer Part Number: N.A.; Part number NEMS: 100500477; Pad Count: 1; Component Status: Active; System: Connector; Part Number: TP_SMD_Ø1.5MM; Footprint Doc: TP_SMD_Ø1.5mm; LatestRevisionDate: 2021-03-05; Published: 2016-06-02; Value: Ø1.5mm,SMD; Note: N.A.; Artikkelnr Noca: N.A.; Part number IPS: N.A.; ComponentLink1URL: N.A.; ComponentLink1Description: Datasheet; ComponentLink2URL: N.A.; ComponentLink2Description: Supplier link; HelpURL: N.A.; Supplier 1: N.A.; Supplier Part Number 1: N.A.; Supplier 2: N.A.; Supplier Part Number 2: N.A.; Component Class: Connectors; PartId: 100500477; Author: rsk; Part number Norautron: N.A.
TP6-TP8 = TP_SMD_Ø1.0MM: 1.0mm circular SMD testpad; Manufacturer: Nordic Semiconductor; Manufacturer Part Number: N.A.; Part number NEMS: 100500475; Pad Count: 1; Component Status: Active; System: Connector; Part Number: TP_SMD_Ø1.0MM; Footprint Doc: TP_SMD_Ø1.0mm; LatestRevisionDate: 2021-03-05; Published: 2013-06-11; Value: Ø1.0mm,SMD; Note: N.A.; Artikkelnr Noca: N.A.; Part number IPS: N.A.; ComponentLink1URL: N.A.; ComponentLink1Description: Datasheet; ComponentLink2URL: N.A.; ComponentLink2Description: Supplier link; HelpURL: N.A.; Supplier 1: N.A.; Supplier Part Number 1: N.A.; Supplier 2: N.A.; Supplier Part Number 2: N.A.; Component Class: Connectors; PartId: 100500475; Author: rsk; Part number Norautron: N.A.
TP27-TP31 TP34-TP36 TP47 = TP_SMD_Ø0.7MM: 0.7mm circular SMD testpad; Manufacturer: Nordic Semiconductor; Manufacturer Part Number: N.A.; Part number NEMS: 100500474; Pad Count: 1; Component Status: Active; System: Connector; Part Number: TP_SMD_Ø0.7MM; PartId: 100500474; Component Class: Connectors; ComponentLink1URL: N.A.; ComponentLink1Description: Datasheet; ComponentLink2URL: N.A.; ComponentLink2Description: Supplier link; HelpURL: N.A.; Footprint Doc: TP_SMD_Ø0.7mm; LatestRevisionDate: 2021-03-05; Published: 2017-12-14; Value: Ø0.7mm,SMD; Note: N.A.; Supplier 1: N.A.; Supplier Part Number 1: N.A.; Supplier 2: N.A.; Supplier Part Number 2: N.A.; Artikkelnr Noca: N.A.; Part number IPS: N.A.; Author: rsk; Part number Norautron: N.A.
U1 = nRF5340-QKAAD0: Multi-protocol Bluetooth Low Energy, IEEE 802.15.4, ANT and 2.4GHz proprietary system-on-chip; Manufacturer: Nordic Semiconductor; Part number Norautron: NOD26470035; Part number NEMS: 102000216; Pad Count: 98; Note: N.A.; Component Status: Active; Part Number: nRF5340-QKAAD0; PartId: 102000216; Component Class: nRF_Devices; Manufacturer Part Number: nRF5340-QKAAD0; ComponentLink1URL: N.A.; ComponentLink1Description: Datasheet; ComponentLink2URL: N.A.; ComponentLink2Description: Supplier link; HelpURL: N.A.; Footprint Doc: AQFN-98; LatestRevisionDate: 2020-12-02; Published: 2020-12-02; Value: nRF5340-QKAA; Supplier 1: Nordic Semiconductor; Supplier Part Number 1: nRF5340-QKAAD0; Supplier 2: N.A.; Supplier Part Number 2: N.A.; Artikkelnr Noca: N.A.; Part number IPS: N.A.; Author: rsk
X1 = XRCGB32M000F1S1BR0: XTAL SMD 2016, 32MHz, Cl=8pF, Tol: ±10ppm, Stab: ±10ppm; Manufacturer: Murata; Part number NEMS: 101600092; Pad Count: 4; Note: XTAL SMD 32.000MHz; Artikkelnr Noca: N.A.; Component Status: Active; Part Number: XRCGB32M000F1S1BR0; LatestRevisionDate: 2020-10-01; Published: 2020-10-01; Value: 32MHz; Footprint Doc: XTAL_2016; Manufacturer Part Number: XRCGB32M000F1S1BR0; ComponentLink1URL: N.A.; ComponentLink1Description: Datasheet; ComponentLink2URL: N.A.; ComponentLink2Description: Supplier link; HelpURL: \\hizz\pro\app9717\Datasheet\crystals\Murata\XRCGB32M000F1S1BR0.pdf; Supplier 1: Murata; Supplier Part Number 1: N.A.; Supplier 2: N.A.; Supplier Part Number 2: N.A.; Part number IPS: N.A.; Component Class: Oscillators; PartId: 101600092; Author: rsk; Part number Norautron: N.A.
X2 = XTAL_SMD2012_32.768kHz_9pF_MC: XTAL SMD 2012, 32.768kHz, 9pF, ±20ppm; Manufacturer: Micro Crystal; Manufacturer Part Number: CM8V-T1A 32.768KHZ 9PF +/-20PPM TA QC; Part number IPS: 00000007828; Part number NEMS: 101600016; Note: XTAL SMD 32.768kHz; Artikkelnr Noca: N.A.; Pad Count: 2; Component Status: Active; Part Number: XTAL_SMD2012_32.768kHz_9pF_MC; LatestRevisionDate: 2017-01-30; Published: 2016-09-15; Value: 32.768kHz; Footprint Doc: XTAL_2012; ComponentLink1URL: N.A.; ComponentLink1Description: Datasheet; ComponentLink2URL: N.A.; ComponentLink2Description: Supplier link; HelpURL: http://www.microcrystal.com/images/_PDF/3_Crystal_Ceramic-Package/cm8v-t1a.pdf; Supplier 1: Allied; Supplier Part Number 1: 70417961; Supplier 2: N.A.; Supplier Part Number 2: N.A.; Component Class: Oscillators; PartId: 101600016; Author: rsk; Part number Norautron: N.A.